# EAGLE schematic shapeTest2 (EAGLE 7.2.0)
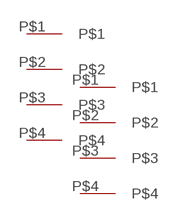
[diagram p0: schematic, sheet 1]

## Parts
U$1  TEST1  [TEST1]
U$2  TEST1  [TEST1]
Unconnected: U$1.P$1 U$1.P$2 U$1.P$3 U$1.P$4 U$2.P$1 U$2.P$2 U$2.P$3 U$2.P$4

## Library data of the parts
U$1 U$2 = shapeTest1:TEST1